# Altium schematic sheet ZHSD-ETHERNET.SchDoc
size A3; DrawnBy: UGUR KELES; DocumentNumber: 11; SheetNumber: 11; SheetTotal: 17; Size: A3
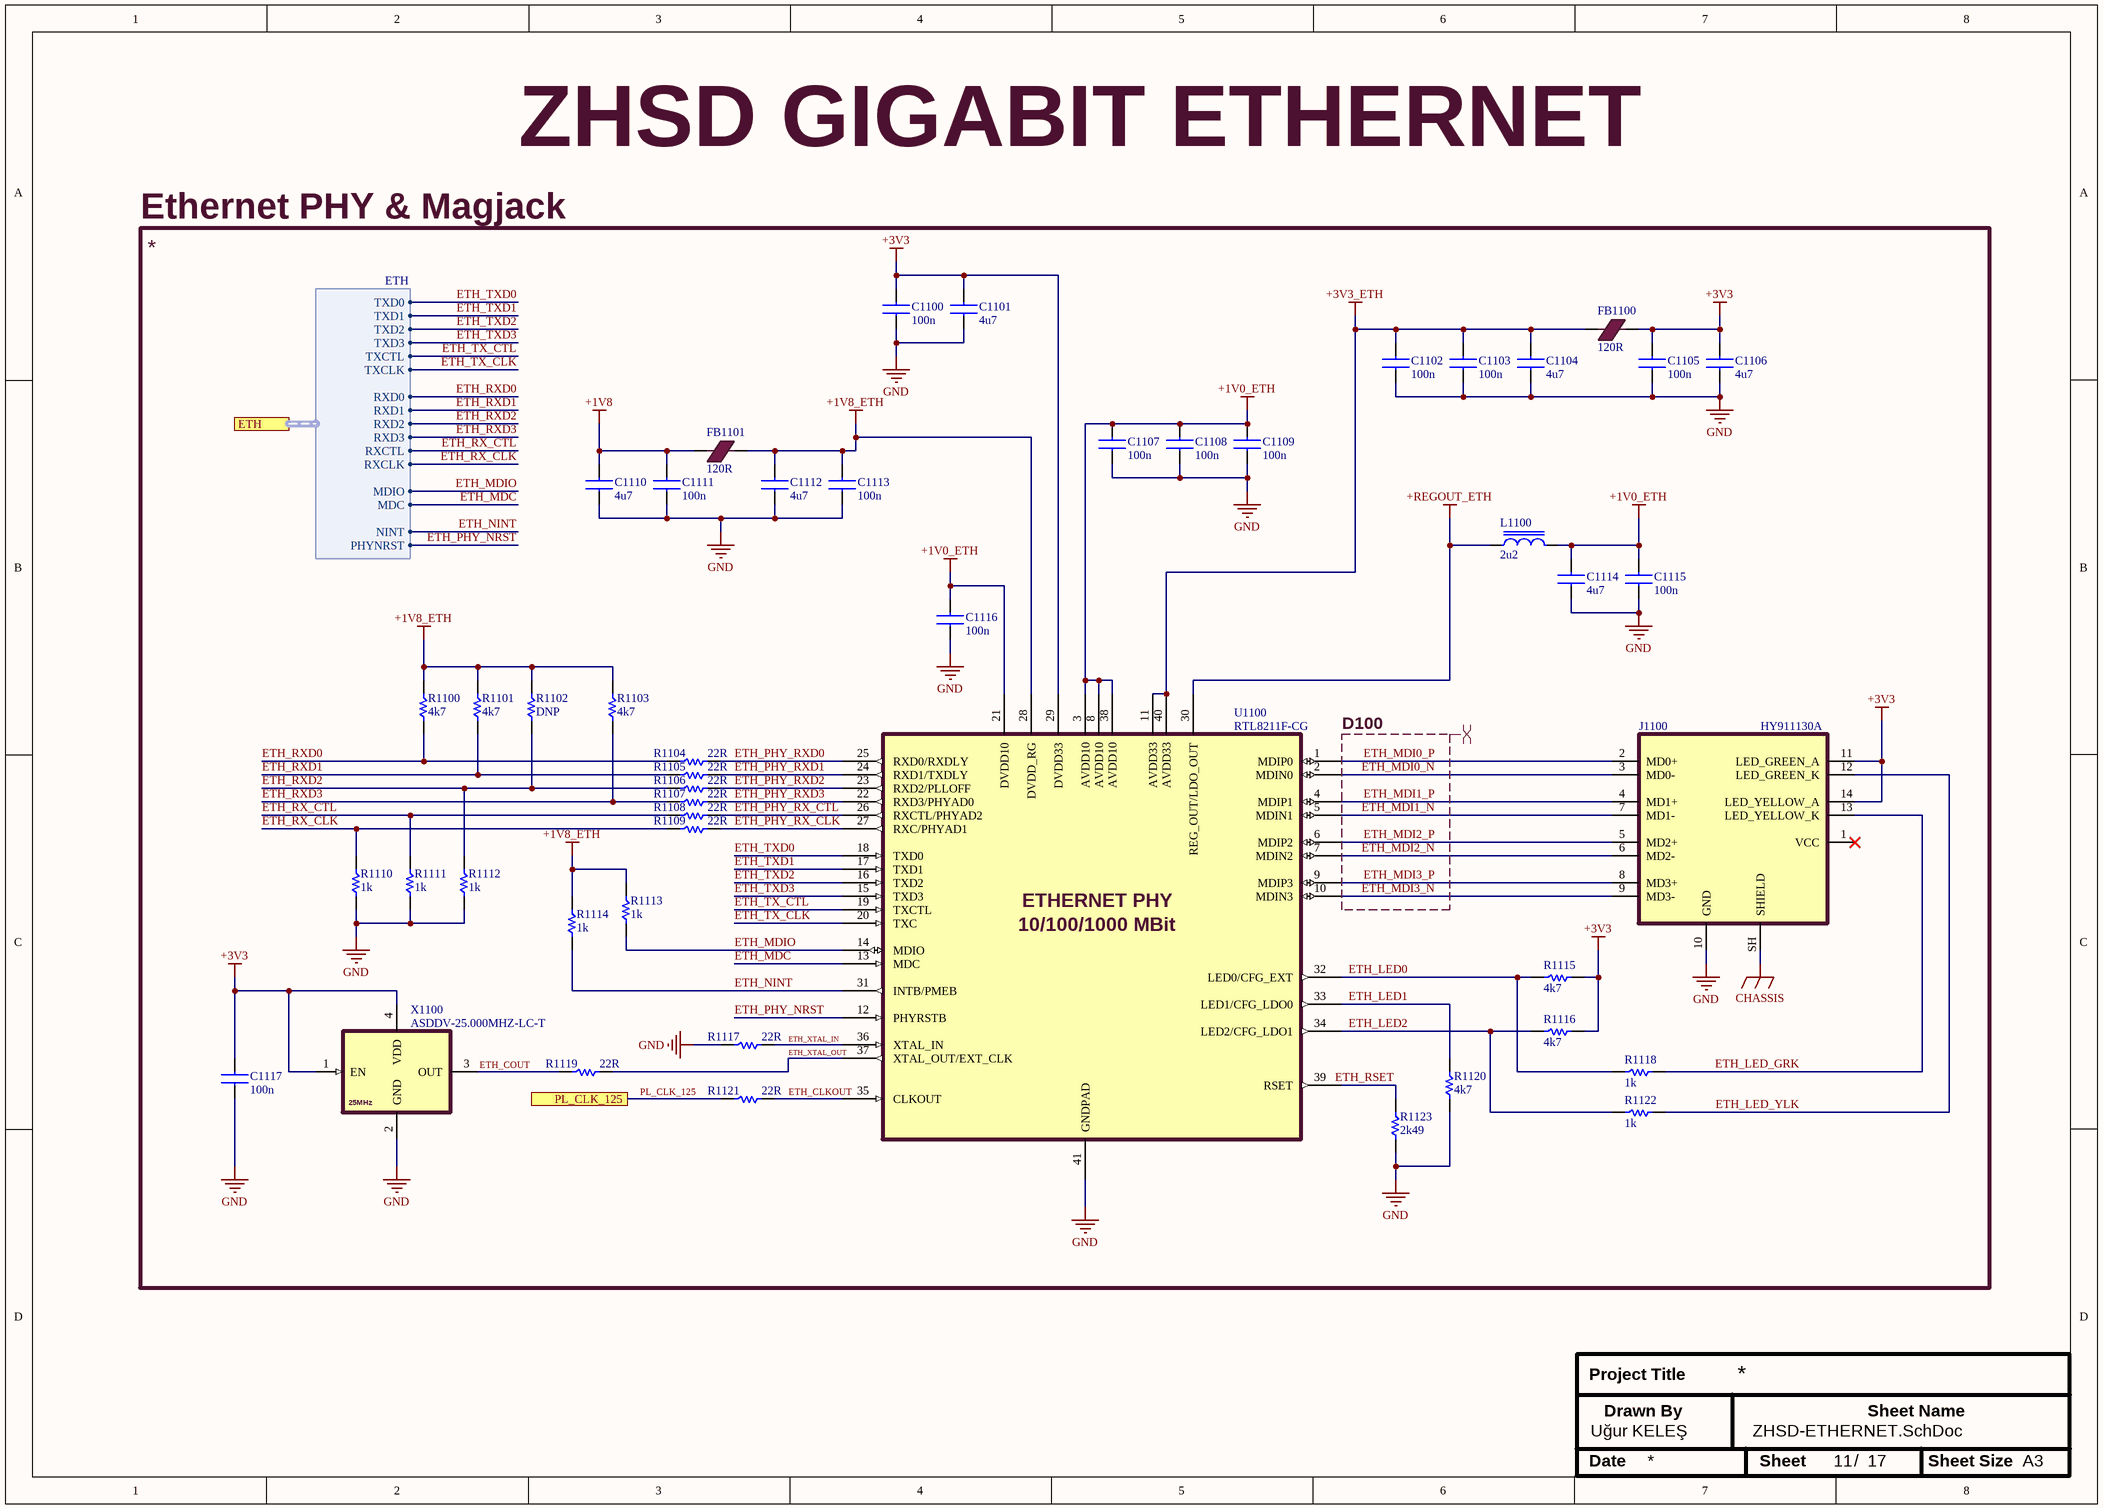
[diagram p0: ZHSD-ETHERNET.SchDoc]

## Parts
C1100  100n  [0603CAPC1608X09N]
C1101  4u7  [0603CAPC1608X09N]
C1102  100n  [0603CAPC1608X09N]
C1103  100n  [0603CAPC1608X09N]
C1104  4u7  [0603CAPC1608X09N]
C1105  100n  [0603CAPC1608X09N]
C1106  4u7  [0603CAPC1608X09N]
C1107  100n  [0603CAPC1608X09N]
C1108  100n  [0603CAPC1608X09N]
C1109  100n  [0603CAPC1608X09N]
C1110  4u7  [0603CAPC1608X09N]
C1111  100n  [0603CAPC1608X09N]
C1112  4u7  [0603CAPC1608X09N]
C1113  100n  [0603CAPC1608X09N]
C1114  4u7  [0603CAPC1608X09N]
C1115  100n  [0603CAPC1608X09N]
C1116  100n  [0603CAPC1608X09N]
C1117  100n  [0603CAPC1608X09N]
FB1100  120R  [0603INDC1608X08N]
FB1101  120R  [0603INDC1608X08N]
J1100  HY911130A  [HY911130A]
L1100  2u2  [0603INDC1608X08N]
R1100  4k7  [0402RESC1005X04N]
R1101  4k7  [0402RESC1005X04N]
R1102  DNP  [0402RESC1005X04N]
R1103  4k7  [0402RESC1005X04N]
R1104  22R  [0603RESC1608X05N]
R1105  22R  [0603RESC1608X05N]
R1106  22R  [0603RESC1608X05N]
R1107  22R  [0603RESC1608X05N]
R1108  22R  [0603RESC1608X05N]
R1109  22R  [0603RESC1608X05N]
R1110  1k  [0402RESC1005X04N]
R1111  1k  [0402RESC1005X04N]
R1112  1k  [0402RESC1005X04N]
R1113  1k  [0402RESC1005X04N]
R1114  1k  [0402RESC1005X04N]
R1115  4k7  [0402RESC1005X04N]
R1116  4k7  [0402RESC1005X04N]
R1117  22R  [0603RESC1608X05N]
R1118  1k  [0402RESC1005X04N]
R1119  22R  [0603RESC1608X05N]
R1120  4k7  [0402RESC1005X04N]
R1121  22R  [0603RESC1608X05N]
R1122  1k  [0402RESC1005X04N]
R1123  2k49  [0402RESC1005X04N]
U1100  RTL8211F-CG  [QFN40P500X500X90_HS-41N]
X1100  ASDDV-25.000MHZ-LC-T  [XTAL_2520]

## Ports
ETH (harness ETH, see ZHSD-Block[4000,2500], ZHSD-ZYNQ-MIO[14200,5300]), PL_CLK_125 (see ZHSD-Block[4000,2300], ZHSD-ZYNQ-PL[13800,7000])

## Harnesses
ETH: TXCLK, TXD0, TXD1, TXD2, TXD3, TXCTL, RXCLK, RXD0, RXD1, RXD2, RXD3, RXCTL, MDIO, MDC, NINT, PHYNRST

## Nets
+1V0_ETH: C1107.2 C1108.2 C1109.2 C1114.2 C1115.2 C1116.2 L1100.2 U1100.3(AVDD10) U1100.8(AVDD10) U1100.21(DVDD10) U1100.38(AVDD10)
+1V8: C1110.2 C1111.2 FB1101.1
+1V8_ETH: C1112.2 C1113.2 FB1101.2 R1100.2 R1101.2 R1102.2 R1103.2 R1113.2 R1114.2 U1100.28(DVDD_RG)
+3V3: C1100.2 C1101.2 C1105.2 C1106.2 C1117.2 FB1100.2 J1100.11(LED_GREEN_A) J1100.14(LED_YELLOW_A) R1115.1 R1116.1 U1100.29(DVDD33) X1100.1(EN) X1100.4(VDD)
+3V3_ETH: C1102.2 C1103.2 C1104.2 FB1100.1 U1100.11(AVDD33) U1100.40(AVDD33)
+REGOUT_ETH: L1100.1 U1100.30(REG_OUT/LDO_OUT)
CHASSIS: J1100.SH(SHIELD)
GND: C1100.1 C1101.1 C1102.1 C1103.1 C1104.1 C1105.1 C1106.1 C1107.1 C1108.1 C1109.1 C1110.1 C1111.1 C1112.1 C1113.1 C1114.1 C1115.1 C1116.1 C1117.1 J1100.10(GND) R1110.1 R1111.1 R1112.1 R1117.2 R1120.1 R1123.1 U1100.41(GNDPAD) X1100.2(GND)
ETH_CLKOUT: R1121.1 U1100.35(CLKOUT)
ETH_COUT: R1119.2 X1100.3(OUT)
ETH_LED0: R1115.2 R1118.2 U1100.32(LED0/CFG_EXT)
ETH_LED1: R1120.2 U1100.33(LED1/CFG_LDO0)
ETH_LED2: R1116.2 R1122.2 U1100.34(LED2/CFG_LDO1)
ETH_LED_GRK: J1100.13(LED_YELLOW_K) R1118.1
ETH_LED_YLK: J1100.12(LED_GREEN_K) R1122.1
ETH_MDC: U1100.13(MDC) ; port ETH.MDC
ETH_MDI0_N: J1100.3(MD0-) U1100.2(MDIN0)
ETH_MDI0_P: J1100.2(MD0+) U1100.1(MDIP0)
ETH_MDI1_N: J1100.7(MD1-) U1100.5(MDIN1)
ETH_MDI1_P: J1100.4(MD1+) U1100.4(MDIP1)
ETH_MDI2_N: J1100.6(MD2-) U1100.7(MDIN2)
ETH_MDI2_P: J1100.5(MD2+) U1100.6(MDIP2)
ETH_MDI3_N: J1100.9(MD3-) U1100.10(MDIN3)
ETH_MDI3_P: J1100.8(MD3+) U1100.9(MDIP3)
ETH_MDIO: R1113.1 U1100.14(MDIO) ; port ETH.MDIO
ETH_NINT: R1114.1 U1100.31(INTB/PMEB) ; port ETH.NINT
ETH_PHY_NRST: U1100.12(PHYRSTB) ; port ETH.PHYNRST
ETH_PHY_RX_CLK: R1109.1 U1100.27(RXC/PHYAD1)
ETH_PHY_RX_CTL: R1108.1 U1100.26(RXCTL/PHYAD2)
ETH_PHY_RXD0: R1104.1 U1100.25(RXD0/RXDLY)
ETH_PHY_RXD1: R1105.1 U1100.24(RXD1/TXDLY)
ETH_PHY_RXD2: R1106.1 U1100.23(RXD2/PLLOFF)
ETH_PHY_RXD3: R1107.1 U1100.22(RXD3/PHYAD0)
ETH_RSET: R1123.2 U1100.39(RSET)
ETH_RX_CLK: R1109.2 R1110.2 ; port ETH.RXCLK
ETH_RX_CTL: R1108.2 R1111.2 ; port ETH.RXCTL
ETH_RXD0: R1100.1 R1104.2 ; port ETH.RXD0
ETH_RXD1: R1101.1 R1105.2 ; port ETH.RXD1
ETH_RXD2: R1102.1 R1106.2 R1112.2 ; port ETH.RXD2
ETH_RXD3: R1103.1 R1107.2 ; port ETH.RXD3
ETH_TX_CLK: U1100.20(TXC) ; port ETH.TXCLK
ETH_TX_CTL: U1100.19(TXCTL) ; port ETH.TXCTL
ETH_TXD0: U1100.18(TXD0) ; port ETH.TXD0
ETH_TXD1: U1100.17(TXD1) ; port ETH.TXD1
ETH_TXD2: U1100.16(TXD2) ; port ETH.TXD2
ETH_TXD3: U1100.15(TXD3) ; port ETH.TXD3
ETH_XTAL_IN: R1117.1 U1100.36(XTAL_IN)
ETH_XTAL_OUT: R1119.1 U1100.37(XTAL_OUT/EXT_CLK)
PL_CLK_125: R1121.2 ; port PL_CLK_125

Not connected (* = marked no-connect by the designer): J1100 1(VCC)*

## Layout directives
differential pair; differential pair class GiE; rule Differential Pairs Routing [Pref Gap = 10mil    Min Gap  = 5mil    Max Gap  = 10milPref Width = 3.937mil    Min Width  = 3.543mil    Max Width  = 3.937mil]: ETH_MDI0_N, ETH_MDI0_P, ETH_MDI1_N, ETH_MDI1_P, ETH_MDI2_N, ETH_MDI2_P, ETH_MDI3_N, ETH_MDI3_P

## Notes on the sheet
- ZHSD GIGABIT ETHERNET
- Ethernet PHY & Magjack
- *
- (near U1100) D100
- Project Title
- Uğur KELEŞ
- Drawn By
- Sheet Name
- Date
- Sheet
- /
- Sheet Size
- A3
- (in symbol ASDDV-25.000MHZ-LC-T) 25MHz
- (in symbol RTL8211F-CG) ETHERNET PHY; 10/100/1000 MBit

## Library data of the parts
C1100 C1102 C1103 C1105 C1107-C1109 C1111 C1113 C1115 C1116 = GRM155R71C104KA88J: CAP CER 0.1UF 16V X7R 0402 (1005) ±10%; Manufacturer: Murata Electronics; Value: 0.1 µF; ComponentLink1Description: Datasheet; ComponentLink1URL: https://search.murata.co.jp/Ceramy/image/img/A01X/G101/ENG/GRM155R71C104KA88-01.pdf; MPN: GRM155R71C104KA88J; Package: 0402; Tolerance: ±10%; Voltage: 16V
C1101 C1104 C1106 C1110 C1112 C1114 = CL10A475KP8NNNC: CAP CER 4.7UF 10V X5R 0603 (1608) ±10%; Manufacturer: Samsung Electro-Mechanics; Value: 4.7 µF; ComponentLink1Description: Datasheet; ComponentLink1URL: https://mm.digikey.com/Volume0/opasdata/d220001/medias/docus/609/CL10A475KP8NNNC_Spec.pdf; MPN: CL10A475KP8NNNC; Package: 0603; Tolerance: ±10%; Voltage: 10V
C1117 = C0603C104K5RACTU: CAP CER 0.1UF 50V X7R 0603 (1608) ±10%; Manufacturer: KEMET; Value: 0.1 µF; ComponentLink1Description: Datasheet; ComponentLink1URL: https://yageogroup.com/content/datasheet/asset/file/KEM_C1002_X7R_SMD; MPN: C0603C104K5RACTU; Package: 0603; Tolerance: ±10%; Voltage: 50V
FB1100 FB1101 = BLM18SG121TN1D: FERRITE BEAD 120 OHM 0603 (1608) 3A 25mOhm; Manufacturer: Murata Electronics; Impedance @ Frequency: 120 Ohms @ 100 MHz; ComponentLink1Description: Datasheet; ComponentLink1URL: https://pim.murata.com/asset/pim4/ferriteBeadInductortypefilter/ENFA0003_PDF_FERRITEBEADINDUCTORTYPEFILTER?lastModifiedDatetime=20250707190934; ComponentLink2Description: Website; ComponentLink2URL: https://pim.murata.com/en-global/pim/details/?partNum=BLM18SG121TN1%23; Current Rating (Max): 3A; DC Resistance (DCR) (Max): 25mOhm; MPN: BLM18SG121TN1D; Package: 0603
J1100 = HY911130A: Jack Modular Connector RJ45 Through Hole Shielded; Manufacturer: Hanrun; MPN: HY911130A; ComponentLink1Description: Datasheet; ComponentLink1URL: https://www.lcsc.com/datasheet/C55679.pdf
L1100 = LQM18PN2R2MGHD: FIXED IND 2.2UH 1.05A 250 MOHM 0603 (1608 Metric); Manufacturer: Murata Electronics; Inductance: 2.2 µH; Current - Saturation (Isat): 250mA; ComponentLink1Description: Datasheet; ComponentLink1URL: https://search.murata.co.jp/Ceramy/image/img/P02/JELF243B-0047.pdf; ComponentLink2Description: Website; ComponentLink2URL: https://pim.murata.com/en-eu/pim/details/?partNum=LQM18PN2R2MGHD; Current Rating (Max): 1.05 A; DC Resistance (DCR) (Max): 250mOhm; MPN: LQM18PN2R2MGHD; Package: 0603
R1100 R1101 R1103 R1115 R1116 R1120 = RC0402JR-074K7L: RES 4.7K OHM 5% 1/16W 0402 (1005); Manufacturer: YAGEO; MPN: RT0402FRE0780RL; Value: 4.7 kOhms; Voltage: 50V; ComponentLink1Description: Datasheet; ComponentLink1URL: https://yageogroup.com/content/datasheet/asset/file/PYU-RC_GROUP_51_ROHS_L; Tolerance: ±5%; Package: 0402
R1102 = DNP_RES: DO NOT POPULATE RESISTOR; Manufacturer: ***; Value: ***; ComponentLink1Description: Datasheet; ComponentLink1URL: https://yageogroup.com/content/datasheet/asset/file/PYU-RT_1-TO-0-01_ROHS_L; MPN: ***; Voltage: ***; Tolerance: ***; Package: 0402
R1104-R1109 R1117 R1119 R1121 = RC0603FR-0722RL: RES 22 OHM 1% 1/10W 0603 (1608); Manufacturer: YAGEO; Value: 22 Ohms; Voltage: 75V; ComponentLink1Description: Datasheet; ComponentLink1URL: https://yageogroup.com/content/datasheet/asset/file/PYU-RC_GROUP_51_ROHS_L; MPN: RC0603FR-0722RL; Tolerance: ±1%; Package: 0603
R1110-R1114 R1118 R1122 = RC0402JR-071KL: RES 1K OHM 5% 1/16W 0402 (1005); Manufacturer: YAGEO; Value: 1 kOhms; Voltage: 50V; ComponentLink1Description: Datasheet; ComponentLink1URL: https://yageogroup.com/content/datasheet/asset/file/PYU-RT_1-TO-0-01_ROHS_L; MPN: RC0402JR-071KL; Tolerance: ±5%; Package: 0402
R1123 = RC0402FR-132K49L: RES 2.49K OHM 1% 1/16W 0402 (1005); Manufacturer: YAGEO; Value: 2.49 kOhms; Voltage: 50V; ComponentLink1Description: Datasheet; ComponentLink1URL: https://yageogroup.com/content/datasheet/asset/file/PYU-RC_GROUP_51_ROHS_L; MPN: RC0402FR-132K49L; Tolerance: ±1%; Package: 0402
U1100 = RTL8211F-CG: RGMII Ethernet Transceiver WQFN-40-EP(5x5) Drivers, Receivers, Transceivers RoHS; Manufacturer: REALTEK; ComponentLink1Description: Datasheet; ComponentLink1URL: https://www.lcsc.com/datasheet/C187932.pdf; MPN: RTL8211F-CG
X1100 = ASDDV-25.000MHZ-LC-T: 25 MHz XO (Standard) HCMOS, LVCMOS Oscillator 1.6V ~ 3.6V Enable/Disable 4-SMD, No Lead; Manufacturer: Abracon LLC; ComponentLink1Description: Datasheet; ComponentLink1URL: https://abracon.com/datasheets/ASDDV.pdf; MPN: ASDDV-25.000MHZ-LC-T